# EAGLE design oldDQ542MA GRBL (EAGLE 8.6.1)
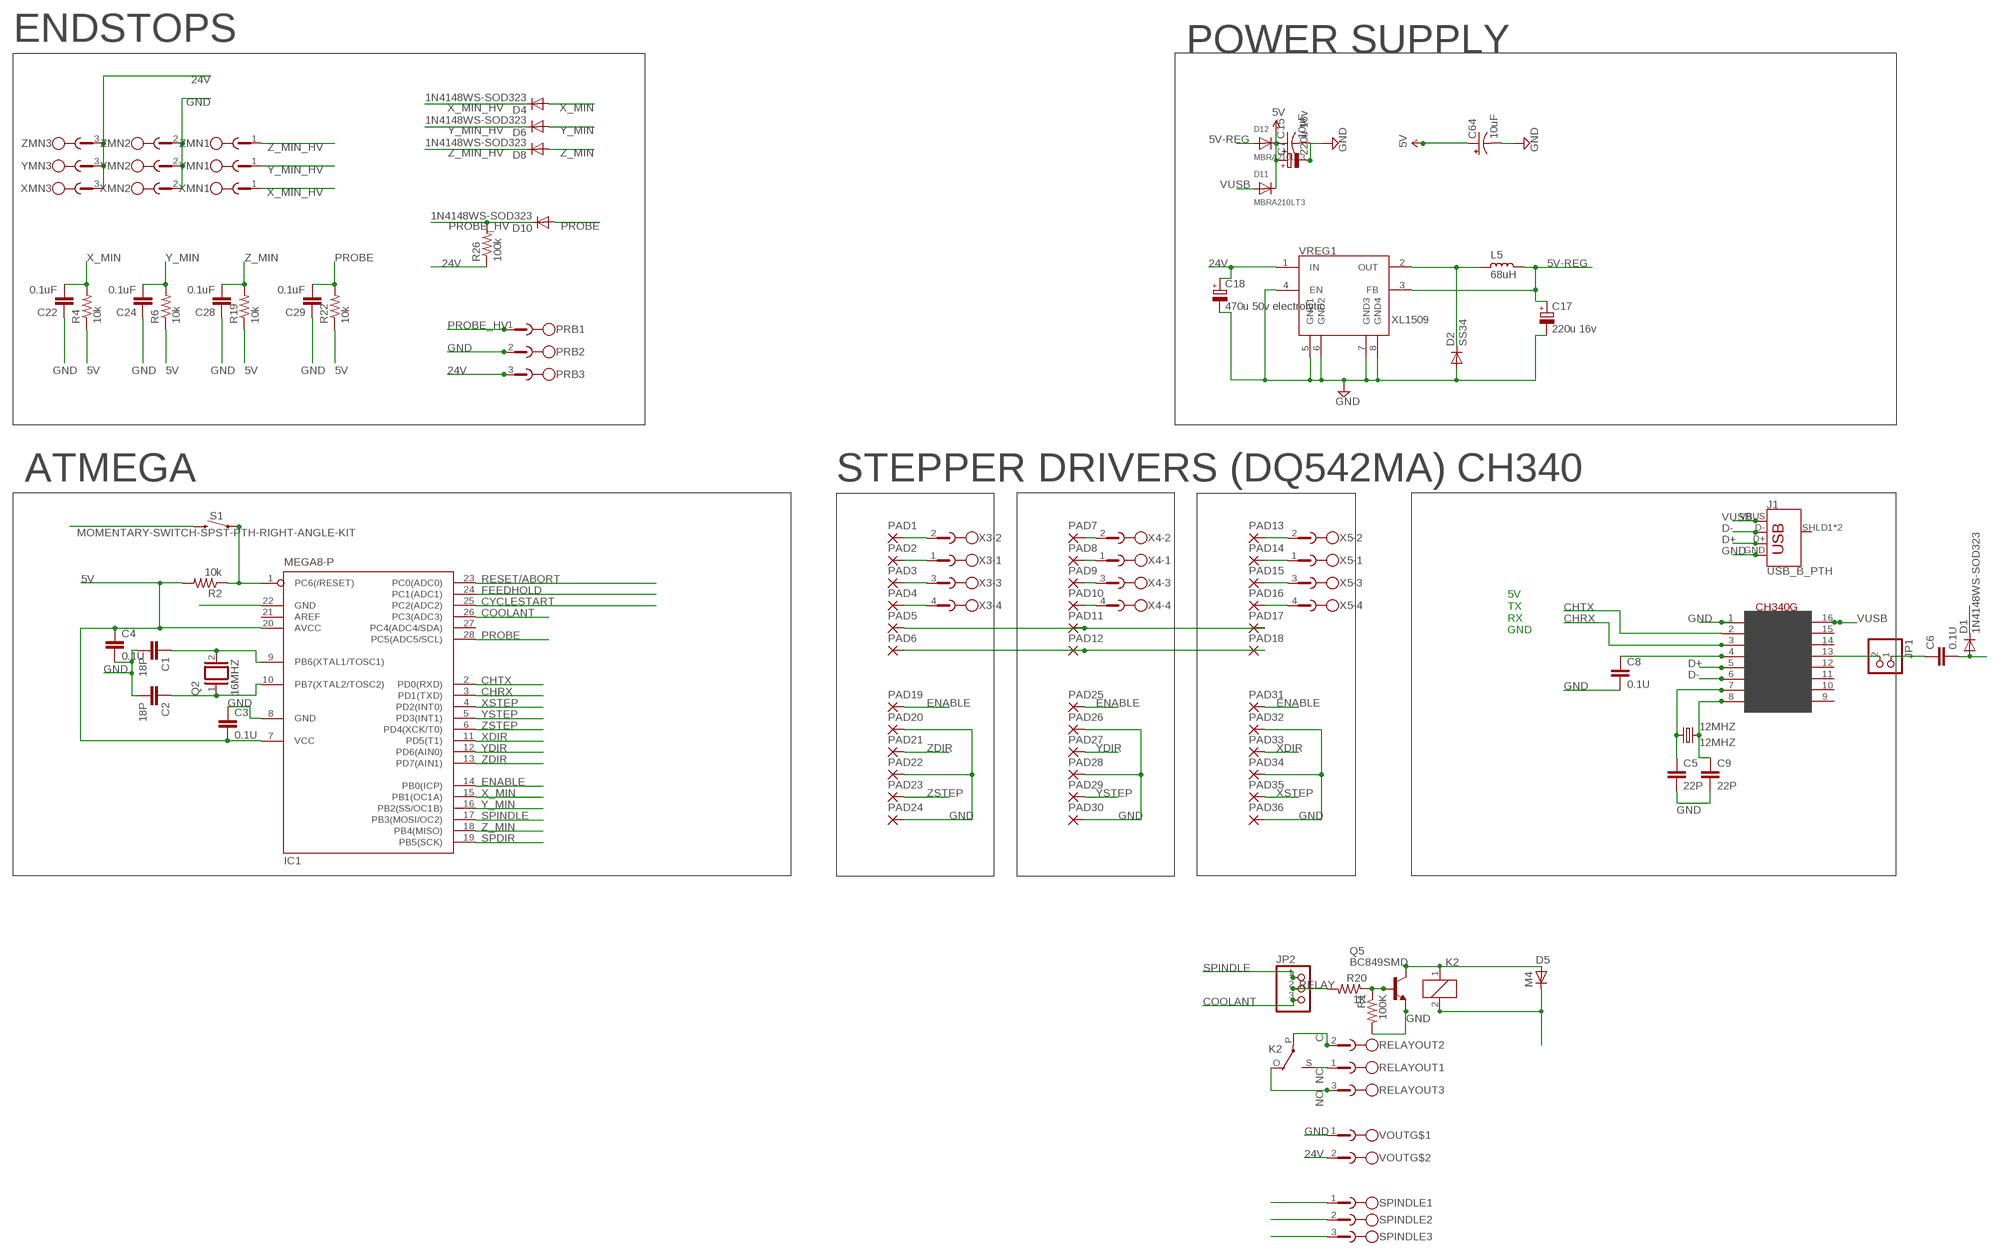
[diagram p0: schematic, sheet 1]

## Parts
12MHZ  12MHZ  CRYSTALHC49U70  [HC49U70]
C1  18P  C-EUC1206  [C1206]
C2  18P  C-EUC1206  [C1206]
C3  0.1U  C-EUC1206  [C1206]
C4  0.1U  C-EUC1206  [C1206]
C5  22P  C-EUC1206  [C1206]
C6  0.1U  C-EUC1206  [C1206]
C7  220u 16v  CPOL-EUE3.5-10  [E3,5-10]
C8  0.1U  C-EUC1206  [C1206]
C9  22P  C-EUC1206  [C1206]
C15  10uF  CAP_POL1206  [EIA3216]
C17  220u 16v  CPOL-EUE3.5-10  [E3,5-10]
C18  470u 50v electrolytic  CPOL-EUE3.5-10  [E3,5-10]
C22  0.1uF  C-EUC1206  [C1206]
C24  0.1uF  C-EUC1206  [C1206]
C28  0.1uF  C-EUC1206  [C1206]
C29  0.1uF  C-EUC1206  [C1206]
C64  10uF  CAP_POL1206  [EIA3216]
D1  1N4148WS-SOD323  DIODE-SOD80C  [SOD80C]
D2  SS34  DIODE-DO-214AC  [DO-214AC]
D4  1N4148WS-SOD323  DIODE-SOD80C  [SOD80C]
D5  M4  D-SOD-80  [SOD80]
D6  1N4148WS-SOD323  DIODE-SOD80C  [SOD80C]
D8  1N4148WS-SOD323  DIODE-SOD80C  [SOD80C]
D10  1N4148WS-SOD323  DIODE-SOD80C  [SOD80C]
D11  MBRA210LT3  DIODESMA  [SMADIODE]
D12  MBRA210LT3  DIODESMA  [SMADIODE]
IC1  MEGA8-P  [DIL28-3]
J1  USB_B_PTH  [USB-B-PTH]
JP1  PINHD-1X2  [1X02]
JP2  PINHD-1X3  [1X03]
K2  G5L  [G5LE]
L5  68uH  L_CD75  [CD75]
PAD1  3,81/1,4  [3,81/1,4]
PAD2  3,81/1,4  [3,81/1,4]
PAD3  3,81/1,4  [3,81/1,4]
PAD4  3,81/1,4  [3,81/1,4]
PAD5  3,81/1,4  [3,81/1,4]
PAD6  3,81/1,4  [3,81/1,4]
PAD7  3,81/1,4  [3,81/1,4]
PAD8  3,81/1,4  [3,81/1,4]
PAD9  3,81/1,4  [3,81/1,4]
PAD10  3,81/1,4  [3,81/1,4]
PAD11  3,81/1,4  [3,81/1,4]
PAD12  3,81/1,4  [3,81/1,4]
PAD13  3,81/1,4  [3,81/1,4]
PAD14  3,81/1,4  [3,81/1,4]
PAD15  3,81/1,4  [3,81/1,4]
PAD16  3,81/1,4  [3,81/1,4]
PAD17  3,81/1,4  [3,81/1,4]
PAD18  3,81/1,4  [3,81/1,4]
PAD19  3,81/1,4  [3,81/1,4]
PAD20  3,81/1,4  [3,81/1,4]
PAD21  3,81/1,4  [3,81/1,4]
PAD22  3,81/1,4  [3,81/1,4]
PAD23  3,81/1,4  [3,81/1,4]
PAD24  3,81/1,4  [3,81/1,4]
PAD25  3,81/1,4  [3,81/1,4]
PAD26  3,81/1,4  [3,81/1,4]
PAD27  3,81/1,4  [3,81/1,4]
PAD28  3,81/1,4  [3,81/1,4]
PAD29  3,81/1,4  [3,81/1,4]
PAD30  3,81/1,4  [3,81/1,4]
PAD31  3,81/1,4  [3,81/1,4]
PAD32  3,81/1,4  [3,81/1,4]
PAD33  3,81/1,4  [3,81/1,4]
PAD34  3,81/1,4  [3,81/1,4]
PAD35  3,81/1,4  [3,81/1,4]
PAD36  3,81/1,4  [3,81/1,4]
PRB  Phoenix Pluggable 3.81mm 3 way  MC1.5/3  [MC1.5/3-G-3.81]
Q2  16MHZ  XTAL/S  [QS]
Q5  BC849SMD  [SOT23-BEC]
R1  100K  R-US_R1206  [R1206]
R2  10k  R-US_R1206  [R1206]
R4  10k  R-US_R1206  [R1206]
R6  10k  R-US_R1206  [R1206]
R19  10k  R-US_R1206  [R1206]
R20  1K  R-US_R1206  [R1206]
R22  10k  R-US_R1206  [R1206]
R26  100k  R-US_R1206  [R1206]
RELAYOUT  Phoenix Pluggable 3.81mm 3 way  MC1.5/3  [MC1.5/3-G-3.81]
S1  MOMENTARY-SWITCH-SPST-PTH-RIGHT-ANGLE-KIT  [TACTILE_SWITCH_PTH_RIGHT_ANGLE_KIT]
SPINDLE  Phoenix Pluggable 3.81mm 3 way  MC1.5/3  [MC1.5/3-G-3.81]
U$2  CH340G  [SOIC16]
VOUT  Phoenix Pluggable 3.81mm 2 way  MC1.5/2  [MC1.5/2-G-3.81]
VREG1  XL1509  [SO08]
X3  Phoenix Pluggable 3.81mm 4 way  MC1.5/4  [MC1.5/4-G-3.81]
X4  Phoenix Pluggable 3.81mm 4 way  MC1.5/4  [MC1.5/4-G-3.81]
X5  Phoenix Pluggable 3.81mm 4 way  MC1.5/4  [MC1.5/4-G-3.81]
XMN  Phoenix Pluggable 3.81mm 3 way  MC1.5/3  [MC1.5/3-G-3.81]
YMN  Phoenix Pluggable 3.81mm 3 way  MC1.5/3  [MC1.5/3-G-3.81]
ZMN  Phoenix Pluggable 3.81mm 3 way  MC1.5/3  [MC1.5/3-G-3.81]

## Nets
5V: C3.2 C4.1 C7.+ C15.A(+) C64.A(+) D1.C D5.1(C) D11.C D12.C IC1.7(VCC) IC1.20(AVCC) K2.2 R2.2 R4.1 R6.1 R19.1 R22.1
5V-REG: C17.+ D12.A L5.1 VREG1.3(FB)
24V: C18.+ PAD6.1(P) PAD12.1(P) PAD18.1(P) PRB.3 R26.1 VOUT.2 VREG1.1(IN) XMN.3 YMN.3 ZMN.3
C: K2.P(2:P) RELAYOUT.2
CHRX: IC1.3(PD1(TXD)) U$2.3(RX)
CHTX: IC1.2(PD0(RXD)) U$2.2(TX)
COIL-: D5.2(A) K2.1 Q5.C
COOLANT: IC1.26(PC3(ADC3)) JP2.3
CYCLESTART: IC1.25(PC2(ADC2))
D+: J1.D+ U$2.5(D+)
D-: J1.D- U$2.6(D-)
DTR: JP1.2 U$2.13(DTR)
ENABLE: IC1.14(PB0(ICP)) PAD19.1(P) PAD25.1(P) PAD31.1(P)
FEEDHOLD: IC1.24(PC1(ADC1))
GND: C1.2 C2.2 C3.1 C4.2 C5.2 C7.- C8.2 C9.2 C15.C(-) C17.- C18.- C22.1 C24.1 C28.1 C29.1 C64.C(-) D2.2(A) IC1.8(GND) IC1.22(GND) J1.GND PAD5.1(P) PAD11.1(P) PAD17.1(P) PAD20.1(P) PAD22.1(P) PAD24.1(P) PAD26.1(P) PAD28.1(P) PAD30.1(P) PAD32.1(P) PAD34.1(P) PAD36.1(P) PRB.2 Q5.E R1.2 S1.2 SPINDLE.1 U$2.1(GND) VOUT.1 VREG1.4(EN) VREG1.5(GND1) VREG1.6(GND2) VREG1.7(GND3) VREG1.8(GND4) XMN.2 YMN.2 ZMN.2
N$2: C6.1 JP1.1
N$3: C1.1 IC1.9(PB6(XTAL1/TOSC1)) Q2.2
N$5: C2.1 IC1.10(PB7(XTAL2/TOSC2)) Q2.1
N$6: PAD10.1(P) X4.4
N$8: PAD8.1(P) X4.1
N$9: 12MHZ.1 C5.1 U$2.7(XI)
N$10: PAD7.1(P) X4.2
N$11: 12MHZ.2 C9.1 U$2.8(XO)
N$13: PAD2.1(P) X3.1
N$14: PAD1.1(P) X3.2
N$15: PAD14.1(P) X5.1
N$16: PAD13.1(P) X5.2
N$32: PAD4.1(P) X3.4
N$35: PAD3.1(P) X3.3
N$38: PAD9.1(P) X4.3
N$40: PAD16.1(P) X5.4
N$42: Q5.B R1.1 R20.1
N$43: PAD15.1(P) X5.3
N$292: D2.1(C) L5.2 VREG1.2(OUT)
NC: K2.S(2:S) RELAYOUT.1
NO: K2.O(2:O) RELAYOUT.3
PROBE: C29.2 D10.A IC1.28(PC5(ADC5/SCL)) R22.2
PROBE_HV: D10.C PRB.1 R26.2
RELAY: JP2.2 R20.2
RESET: C6.2 D1.A IC1.1(PC6(/RESET)) R2.1 S1.1
RESET/ABORT: IC1.23(PC0(ADC0))
SPDIR: IC1.19(PB5(SCK)) SPINDLE.3
SPINDLE: IC1.17(PB3(MOSI/OC2)) JP2.1 SPINDLE.2
V3: C8.1 U$2.4(V3)
VUSB: D11.A J1.VBUS U$2.16(VCC)
X_MIN: C22.2 D4.A IC1.15(PB1(OC1A)) R4.2
X_MIN_HV: D4.C XMN.1
XDIR: IC1.11(PD5(T1)) PAD33.1(P)
XSTEP: IC1.4(PD2(INT0)) PAD35.1(P)
Y_MIN: C24.2 D6.A IC1.16(PB2(SS/OC1B)) R6.2
Y_MIN_HV: D6.C YMN.1
YDIR: IC1.12(PD6(AIN0)) PAD27.1(P)
YSTEP: IC1.5(PD3(INT1)) PAD29.1(P)
Z_MIN: C28.2 D8.A IC1.18(PB4(MISO)) R19.2
Z_MIN_HV: D8.C ZMN.1
ZDIR: IC1.13(PD7(AIN1)) PAD21.1(P)
ZSTEP: IC1.6(PD4(XCK/T0)) PAD23.1(P)
Unconnected: IC1.21(AREF) IC1.27(PC4(ADC4/SDA)) J1.SHLD1(SHIELD) J1.SHLD2(SHIELD) U$2.9(CTS) U$2.10(DSR) U$2.11(RI) U$2.12(DCD) U$2.14(RTS) U$2.15(RS232)

## Notes on the sheet
- ENDSTOPS | POWER SUPPLY
- ATMEGA | STEPPER DRIVERS (DQ542MA) | CH340
- 5V
  TX
  RX
  GND

## Library data of the parts
12MHZ = crystal:CRYSTAL: CRYSTAL; OC_FARNELL: unknown; OC_NEWARK: unknown
C1-C6 C8 C9 C22 C24 C28 C29 = rcl:C-EU: CAPACITOR, European symbol
C7 C17 C18 = rcl:CPOL-EU: POLARIZED CAPACITOR, European symbol
C15 C64 = SparkFun:CAP_POL: Capacitor Polarized These are standard SMD and PTH capacitors. Normally 10uF, 47uF, and 100uF in electrolytic and tantalum varieties. Always verify the external diameter of the through hole cap, it varies with capacity, voltage, and manufacturer. The EIA devices should be standard.
D1 D4 D6 D8 D10 = diode:DIODE-: DIODE
D2 = dp_devices:DIODE: Various Diode Packages
D5 = semicon-smd-ipc:D-: DIODE unfilled
D11 D12 = microbuilder:DIODE: Diode SMADIODE - SMA Surface Mount Package 20V 1A Schottky Diode Digikey (500mV @ 1A, 500uA Vr @ 20V): 641-1014-6-ND 10V 2A Schottky Diode Digikey (350mV @ 2A, 700uA Vr @ 10V): MBRA210LT3 SOD-123 30V 200mA (800mV Vf, 2uA Vr @ 25V) Schottky Diode (very fast switching for boost, etc.) - Digikey: BAT54T1GOSTR-ND 30V 500mA (430mV Vf, 130uA Vr @ 30V) Schottky Diode - Digikey: B0530W-FDICT-ND MBR120 1A 20V (0.34Vf) Schottky Diode - Digikey: MBR120VLSFT1GOSCT-ND SOD-323 10V 570mA (380mV Vf, 3ns) Schottky Diode - Digikey: ZLLS410CT-ND 1N4148WS - 75V 150mA (1V Vf @ 10mA, 4ns) Simple Diode - Digikey: 1N4148WSFSCT-ND, Mouser: 512-1N4148WS SOD-523 BAT54 30V 200mA Schottky (0.8 Vf @ 100mA, 5ns) - Digikey: BAT54XV2CT-ND 30V 30mA Schottky Diode (RB751S-40TE61) - Digikey: RB751S-40TE61CT-ND SOT23-R/W - SOT23 Package (R = Solder Paste/Reflow Ovens, W = Hand-Soldering) BAT54Film 40V 300mA - Digikey: 497-7162-1-ND DO-1N4148 Through Hole Small Current Diode (any model)
IC1 = atmel:MEGA8-P: MICROCONTROLLER 8 Kbytes FLASH, 1 kbytes SRAM, 512 bytes EEPROM, USART, 4-channel 10 bit ADC, 2-channel 8 bit ADC Pin compatible with Atmega48, ATMega88, ATMega168 Source: avr.lbr; OC_FARNELL: unknown; OC_NEWARK: unknown
J1 = SparkFun-Connectors:USB_B: USB Type B Connector SparkFun Products: SparkFun Stepoko <https://www.sparkfun.com/products/13899> PTH; PROD_ID: CONN-08278; SF_ID: PRT-00139
JP1 = pinhead:PINHD-1X2: PIN HEADER
JP2 = pinhead:PINHD-1X3: PIN HEADER
K2 = relay:G5L: RELAY 1 x switch, 10 A/120 V AC, 8 A/30 V ADC, Omron; OC_FARNELL: unknown; OC_NEWARK: unknown
L5 = rc-master-smd:L_: INDUCTOR
PAD1-PAD36 = wirepad:3,81/1,4: THROUGH-HOLE PAD
PRB RELAYOUT SPINDLE XMN YMN ZMN = jt-con-phoenix-3.81:MC1.5/3: PHOENIX
Q2 = special:XTAL/S: CRYSTAL
Q5 = transistor-npn:BC849*: NPN Transistor
R1 R20 = adafruit:R-US_: RESISTOR, American symbol
R2 R4 R6 R19 R22 R26 = resistor:R-US_: RESISTOR, American symbol
S1 = SparkFun-Switches:MOMENTARY-SWITCH-SPST: Momentary Switch (Pushbutton) - SPST Normally-open (NO) SPST momentary switches (buttons, pushbuttons). Variants PTH-12MM - 12mm square, through-hole Momentary Pushbutton Switch - 12mm Square <https://www.sparkfun.com/products/9190> (COM-09190) PTH-6.0MM, PTH-6.0MM-KIT - 6.0mm square, through-hole Mini Pushbutton Switch <https://www.sparkfun.com/products/97> (COM-00097) KIT package intended for soldering kit's - only one side of pads' copper is exposed. PTH-RIGHT-ANGLE-KIT - Right-angle, through-hole Right Angle Tactile Button <https://www.sparkfun.com/products/10791> - Used on SparkFun BigTime Watch Kit <https://www.sparkfun.com/products/11734> SMD-12MM - 12mm square, surface-mount Tactile Button - SMD (12mm) <https://www.sparkfun.com/products/12993> (COM-12993) Used on SparkFun PicoBoard <https://www.sparkfun.com/products/11888> SMD-4.5MM - 4.5mm Square Trackball Switch Used on SparkFun Blackberry Trackballer Breakout <https://www.sparkfun.com/products/13169> SMD-4.6MMX2.8MM - 4.60mm x 2.80mm, surface mount Used on SparkFun SAMD21 Mini Breakout <https://www.sparkfun.com/products/13664> SMD-5.2MM, SMD-5.2-REDUNDANT - 5.2mm square, surface-mount Mini Pushbutton Switch - SMD <https://www.sparkfun.com/products/8720> (COM-08720) Used on Arduino Pro Mini <https://www.sparkfun.com/products/11114> REDUNDANT package connects both switch circuits together SMD-6.0X3.5MM - 6.0 x 3.5mm, surface mount Momentary Reset Switch SMD <https://www.sparkfun.com/products/8229> (COM-08229) SMD-6.2MM-TALL - 6.2mm square, surface mount Tactile Button - SMD (6mm) <https://www.sparkfun.com/products/12992> Used on SparkFun Digital Sandbox <https://www.sparkfun.com/products/12651> SMD-RIGHT-ANGLE - Right-angle, surface mount Used on SparkFun Block for Intel® Edison - Arduino <https://www.sparkfun.com/products/13036>; PROD_ID: CONN-10672; SF_SKU: COM-10791
U$2 = usb-serial:CH340G
VOUT = jt-con-phoenix-3.81:MC1.5/2
VREG1 = Cohesion_parts:XL1509
X3-X5 = jt-con-phoenix-3.81:MC1.5/4: PHOENIX

## Net classes
1 power: width 0.6 mm, clearance 0.305 mm
5 3.3-Amp Class: width 1.27 mm

## Board
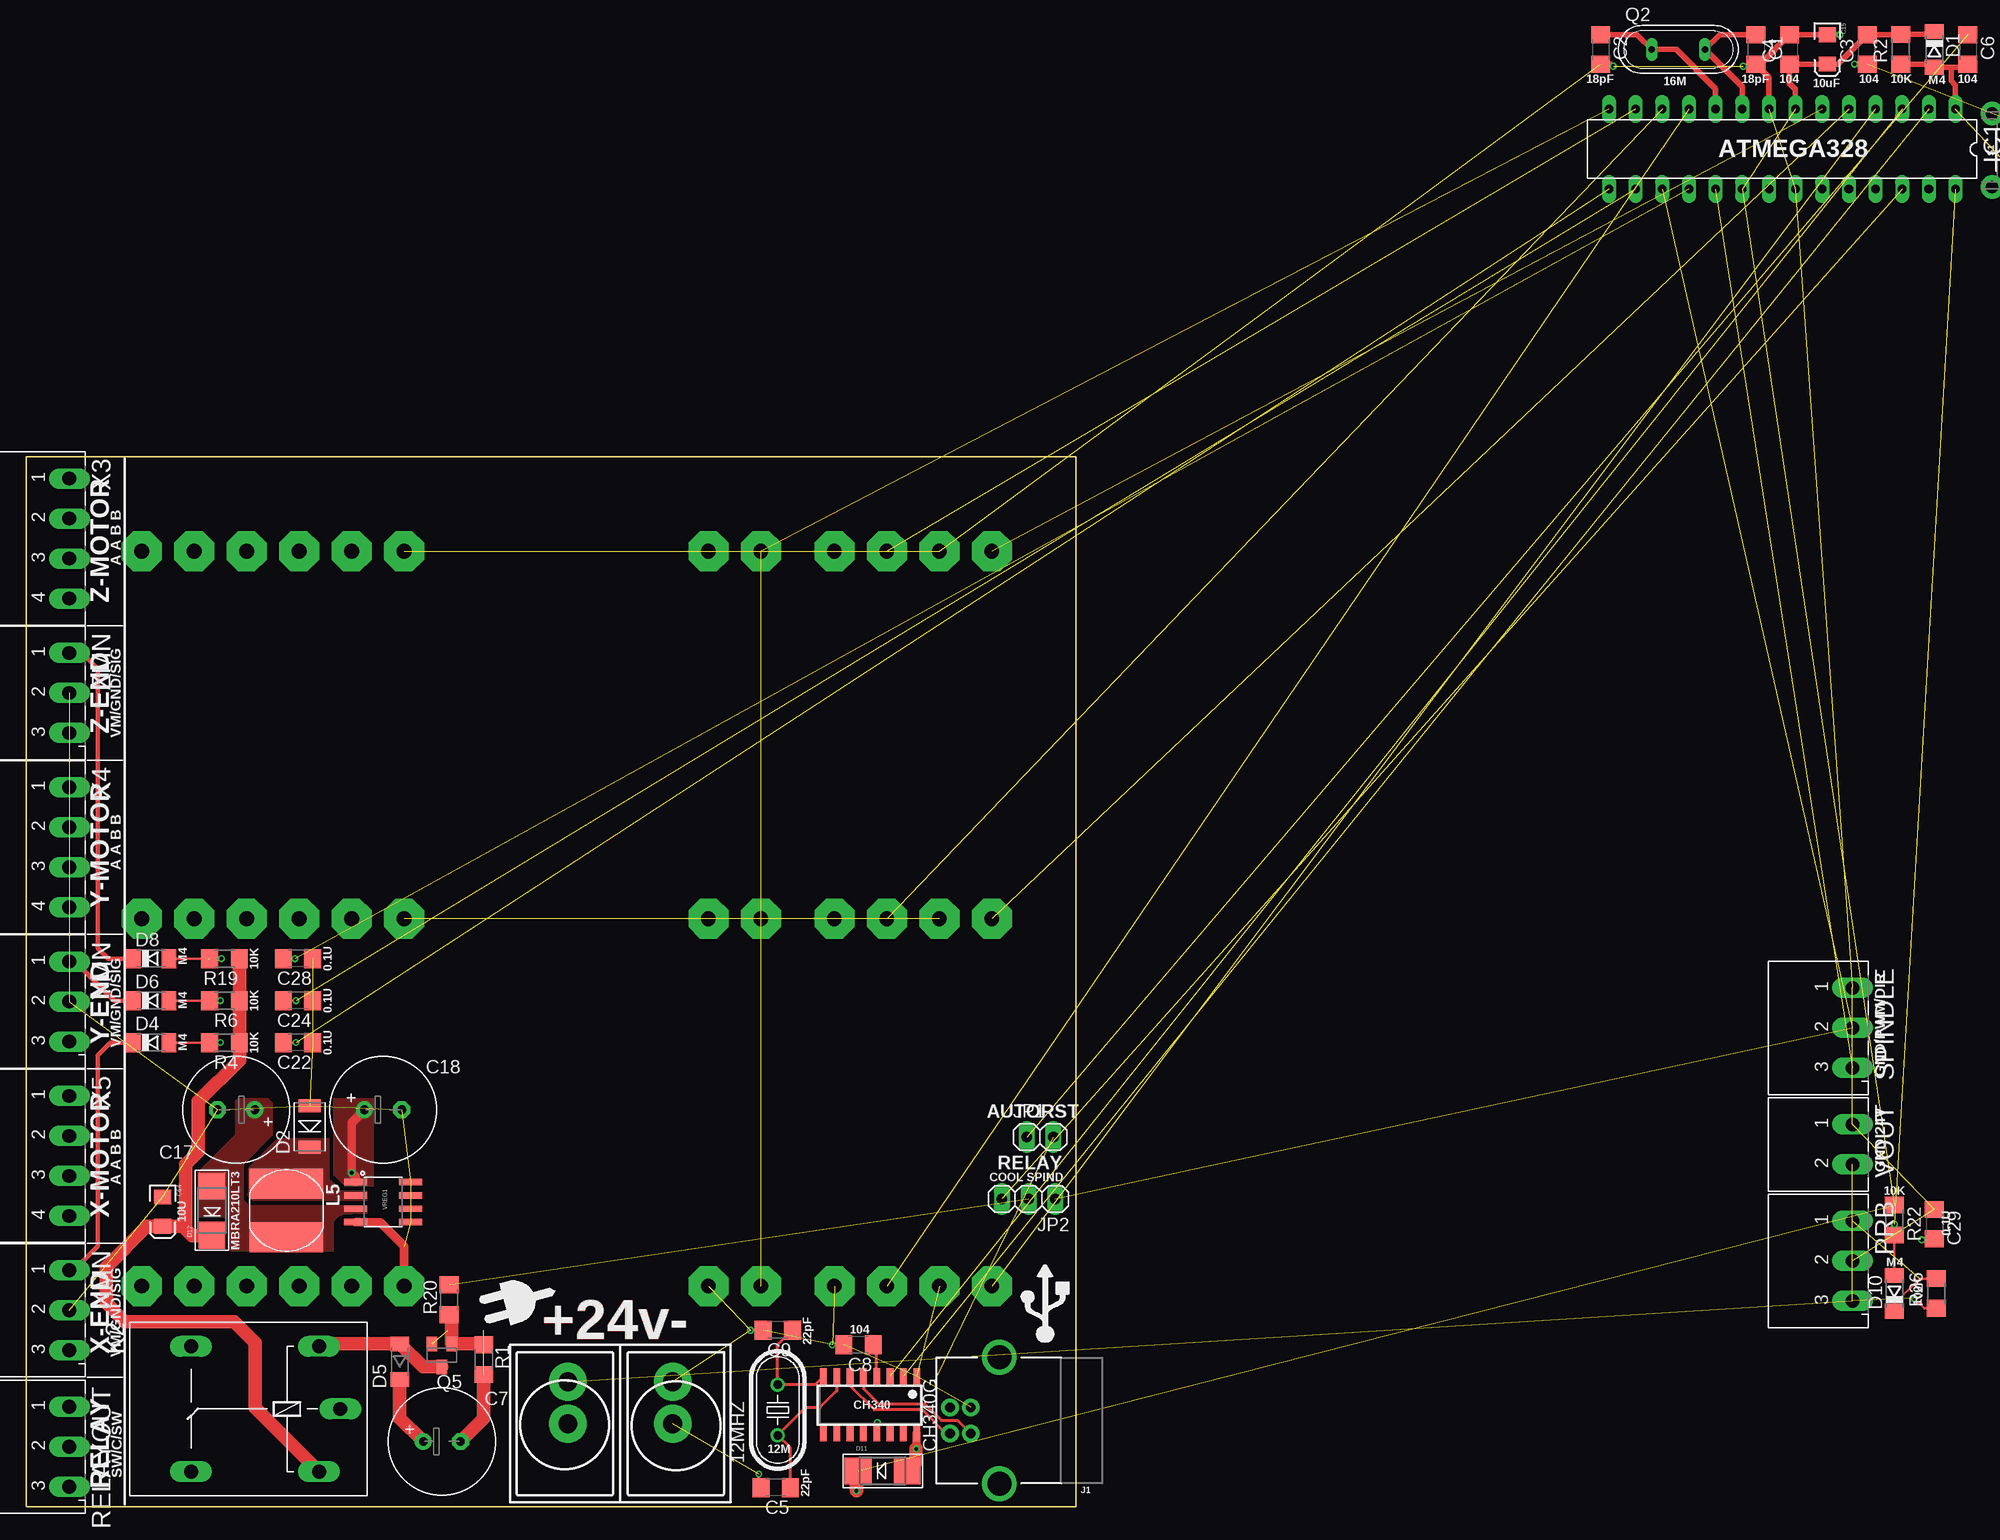
[diagram p1: board, top side]
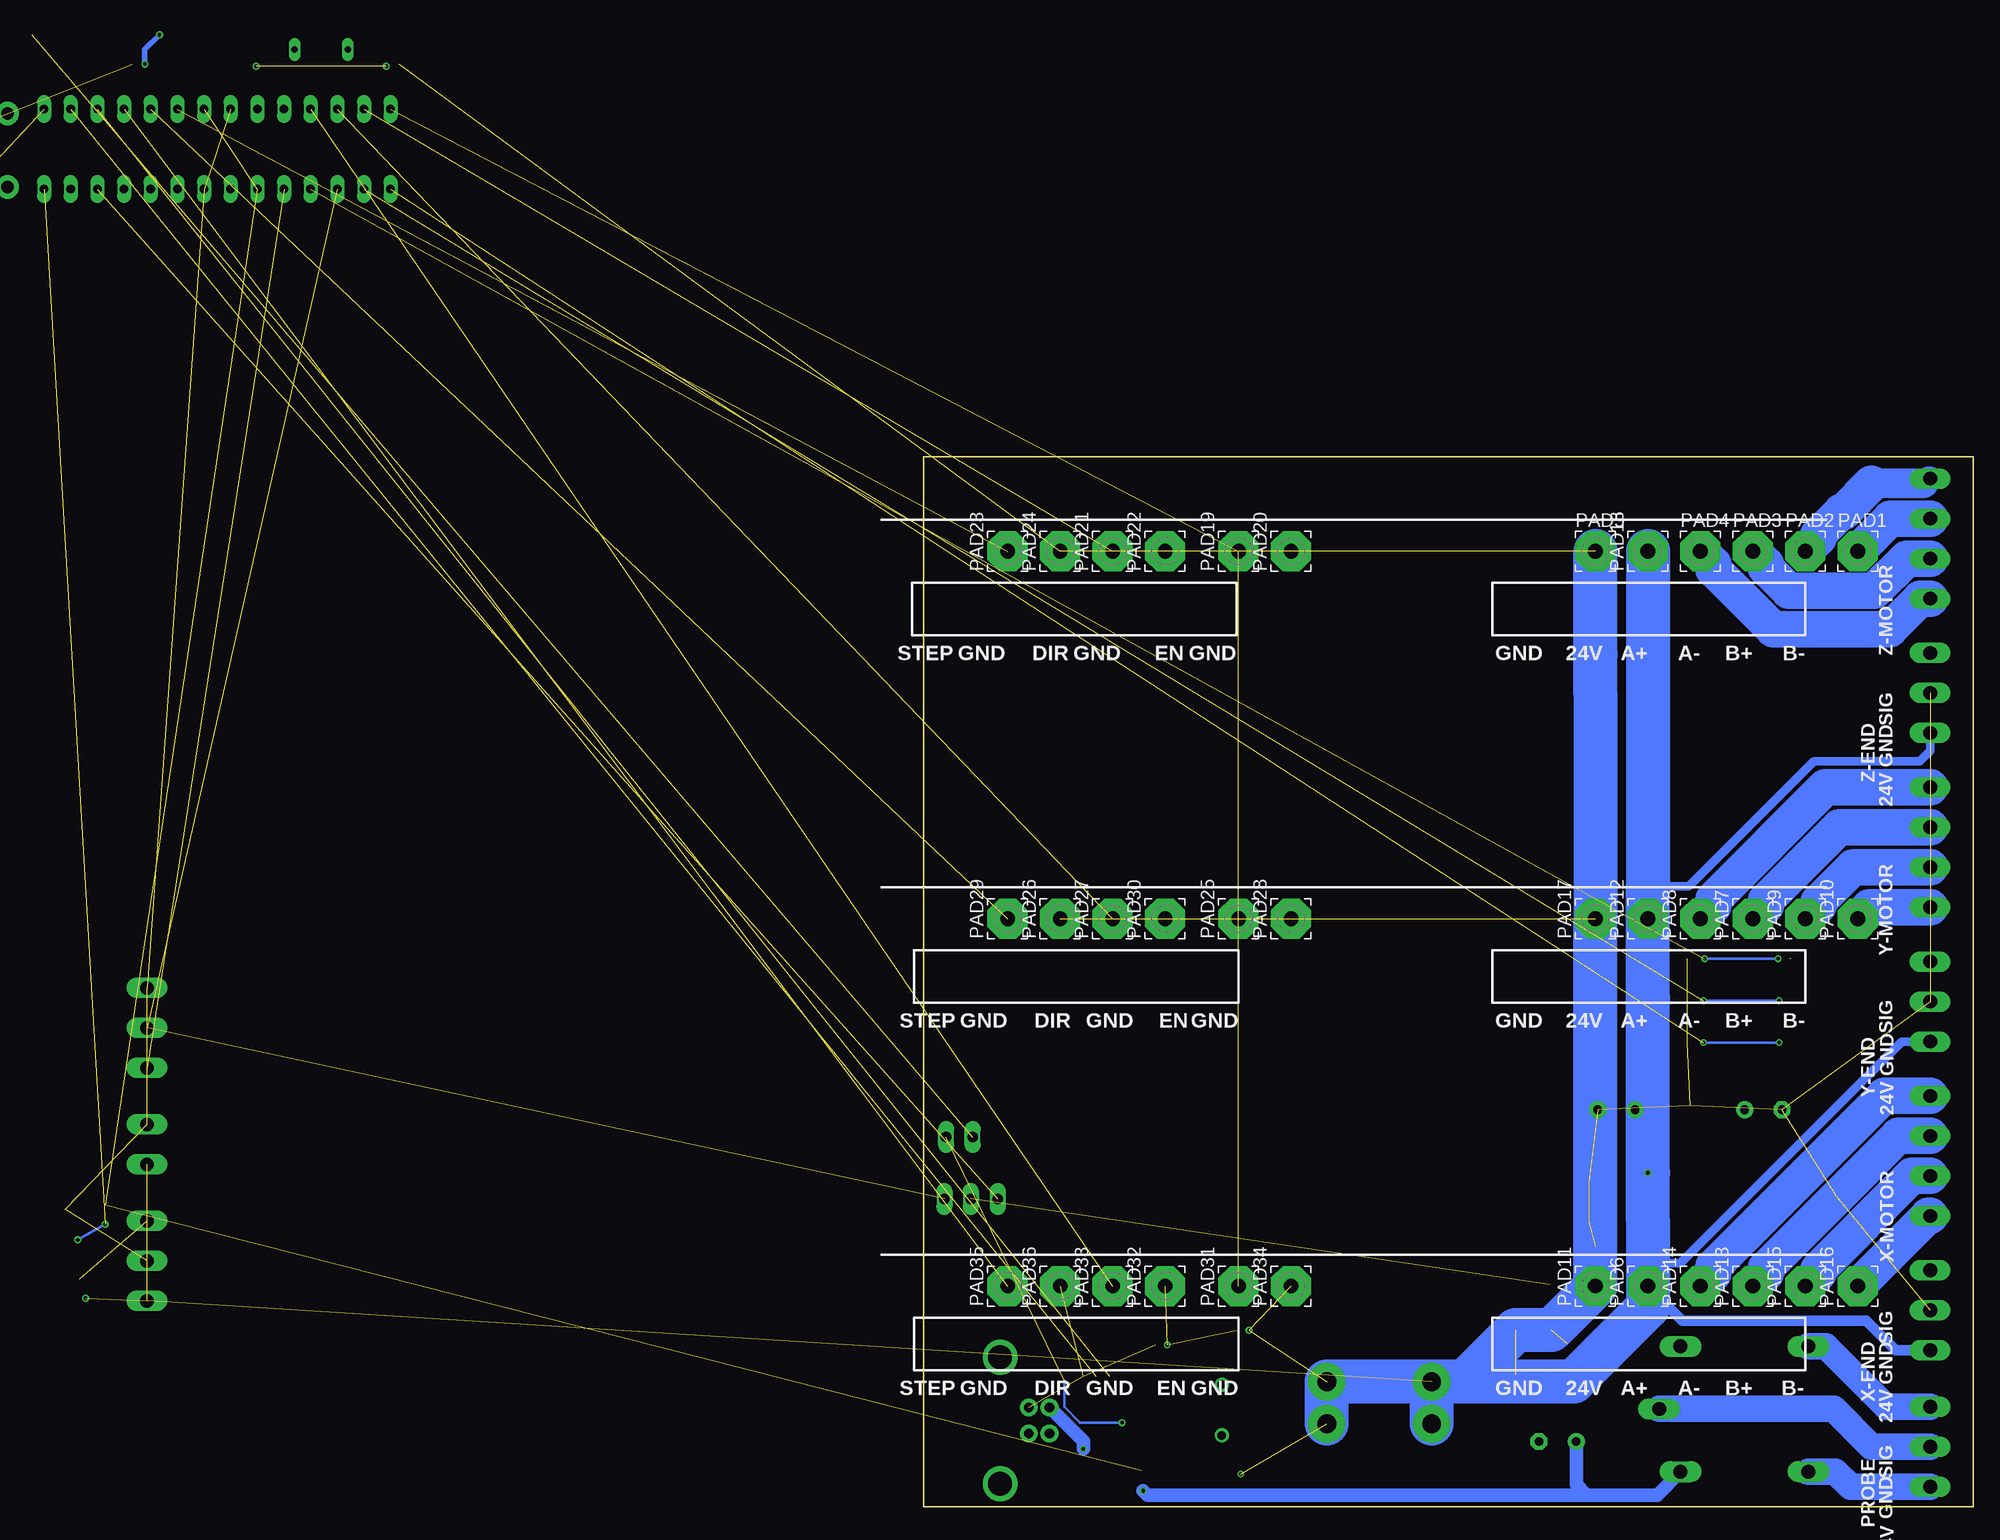
[diagram p2: board, bottom side, seen from below]

Size 100 x 100 mm. Coordinates in mm from the lower left corner, seen from the top.
Outline: 100,100 100,0 0,0 0,100 100,100
Copper layers (1*16): Top 0.035mm / dielectric 1.5mm / Bottom 0.035mm
Design rules "dirt_cheap_dirty_boards.v1": minimum track width 5mil, minimum drill 12mil, track to track 5mil, track to pad 5mil, pad to pad 5mil, via to via 5mil, smd to smd 0mil, copper to edge 10mil, drill to drill 10mil, minimum pad ring 10mil, minimum via ring 6mil, stop-mask expansion 2mil, vias tented up to drill 25mil, thermal gap 10mil
tRestrict: area 43.2,17.3 to 50.4,21.5

### Footprints (pad centres in the part's own frame; a part is rotated, then mirrored left to right if it is on the bottom)
HC49U70 = drill 0.813: 1 -2.413,0; 2 2.413,0
C1206 = smd 1.6 x 1.8: 1 -1.4,0; 2 1.4,0
E3,5-10 = drill 0.813 pad 1.6: + -1.778,0 | drill 0.813 pad 1.6 octagon: - 1.778,0
EIA3216 = smd 1.4 x 1.6: A 1.4,0; C -1.4,0
SOD80C = smd 1.4 x 1.8: A 1.7,0; C -1.7,0
DO-214AC = smd 1.27 x 2.1: 1 -1.98,0; 2 1.98,0
SOD80 = smd 1.4 x 1.8: 1 -1.7,0; 2 1.7,0
SMADIODE = smd 2.54 x 2.54: A 2.349,0; C -2.349,0
DIL28-3 = drill 0.813 long: 1 -16.51,-3.81; 2 -13.97,-3.81; 3 -11.43,-3.81; 4 -8.89,-3.81; 5 -6.35,-3.81; 6 -3.81,-3.81; 7 -1.27,-3.81; 8 1.27,-3.81; 9 3.81,-3.81; 10 6.35,-3.81; 11 8.89,-3.81; 12 11.43,-3.81; 13 13.97,-3.81; 14 16.51,-3.81; 15 16.51,3.81; 16 13.97,3.81; 17 11.43,3.81; 18 8.89,3.81; 19 6.35,3.81; 20 3.81,3.81; 21 1.27,3.81; 22 -1.27,3.81; 23 -3.81,3.81; 24 -6.35,3.81; 25 -8.89,3.81; 26 -11.43,3.81; 27 -13.97,3.81; 28 -16.51,3.81
USB-B-PTH = drill 0.914 pad 1.676: D+ 4,1.25; D- 5.981,1.25; GND 4,-1.25; VBUS 5.981,-1.25 | drill 2.286: SHLD1 1.282,-6.02; SHLD2 1.282,6.02
1X02 = drill 1.016 long: 1 -1.27,0; 2 1.27,0
1X03 = drill 1.016 long: 1 -2.54,0; 2 0,0; 3 2.54,0
G5LE = drill 1.321 long: 1 -7.493,-5.969; 2 -7.493,5.969; O 4.699,5.969; P -9.525,0; S 4.699,-5.969
CD75 = smd 7 x 2.85: 1 0,2.54; 2 0,-2.54
3,81/1,4 = drill 1.397 pad 3.81 octagon: 1 0,0
MC1.5/3-G-3.81 = drill 1.3 long: 1 -3.81,8; 2 0,8; 3 3.81,8
QS = drill 0.61 long: 1 -2.54,0; 2 2.54,0
SOT23-BEC = smd 1 x 1.4: B -0.95,-1.1; C 0,1.1; E 0.95,-1.1
R1206 = smd 1.6 x 1.803: 1 -1.422,0; 2 1.422,0
TACTILE_SWITCH_PTH_RIGHT_ANGLE_KIT = drill 0.8 pad 1.7: 1 -2.5,0; 2 2.5,0 | drill 1.2 pad 2.2: ANCHOR1 -3.5,2.5; ANCHOR2 3.5,2.5
SOIC16 = smd 0.635 x 1.524: 1 -4.445,-2.695; 2 -3.175,-2.695; 3 -1.905,-2.695; 4 -0.635,-2.695; 5 0.635,-2.695; 6 1.905,-2.695; 7 3.175,-2.695; 8 4.445,-2.695; 9 4.445,2.695; 10 3.175,2.695; 11 1.905,2.695; 12 0.635,2.695; 13 -0.635,2.695; 14 -1.905,2.695; 15 -3.175,2.695; 16 -4.445,2.695
MC1.5/2-G-3.81 = drill 1.3 long: 1 -3.81,8; 2 0,8
SO08 = smd 0.61 x 2.21: 1 -1.905,-2.616; 2 -0.635,-2.616; 3 0.635,-2.616; 4 1.905,-2.616; 5 1.905,2.616; 6 0.635,2.616; 7 -0.635,2.616; 8 -1.905,2.616
MC1.5/4-G-3.81 = drill 1.3 long: 1 -9.525,8; 2 -5.715,8; 3 -1.905,8; 4 1.905,8

### Placement (x,y rotation side)
12MHZ  71.6,9.2 90 top
C1  164.8,138.8 270 top  (outside the outline)
C2  150,138.8 270 top  (outside the outline)
C3  175.4,138.8 90 top  (outside the outline)
C4  168,138.8 90 top  (outside the outline)
C5  71.4,1.8 180 top
C6  185,138.8 270 top  (outside the outline)
C7  39.6,6.2 0 top
C8  79.3,15.4 180 top
C9  71.6,16.8 180 top
C15  171.6,138.8 270 top  (outside the outline)
C17  20,37.8 180 top
C18  34,37.8 0 top
C22  25.9,44.2 180 top
C24  25.9,48.2 180 top
C28  25.9,52.2 180 top
C29  181.8,26.9 270 top  (outside the outline)
C64  13,28.1 270 top
D1  181.8,138.8 270 top  (outside the outline)
D2  27,36.2 90 top
D4  11.9,44.2 0 top
D5  35.6,13.8 90 top
D6  11.9,48.2 0 top
D8  11.9,52.2 0 top
D10  178,20.3 90 top  (outside the outline)
D11  81.6,3.4 0 top
D12  17.7,28.2 90 top
IC1  167.3,129.3 180 top  (outside the outline)
J1  94,8.2 180 top
JP1  96.6,35.2 0 top
JP2  95.5,29.3 180 top
K2  20.4,9.3 180 top
L5  24.8,28.2 180 top
PAD1  11,91 0 bottom
PAD2  16,91 0 bottom
PAD3  21,91 0 bottom
PAD4  26,91 0 bottom
PAD5  36,91 0 bottom
PAD6  31,21 90 bottom
PAD7  21,56 90 bottom
PAD8  26,56 90 bottom
PAD9  16,56 90 bottom
PAD10  11,56 90 bottom
PAD11  36,21 90 bottom
PAD12  31,56 90 bottom
PAD13  21,21 90 bottom
PAD14  26,21 90 bottom
PAD15  16,21 90 bottom
PAD16  11,21 90 bottom
PAD17  36,56 90 bottom
PAD18  31,91 90 bottom
PAD19  70,91 90 bottom
PAD20  65,91 90 bottom
PAD21  82,91 90 bottom
PAD22  77,91 90 bottom
PAD23  92,91 90 bottom
PAD24  87,91 90 bottom
PAD25  70,56 90 bottom
PAD26  87,56 90 bottom
PAD27  82,56 90 bottom
PAD28  65,56 90 bottom
PAD29  92,56 90 bottom
PAD30  77,56 90 bottom
PAD31  70,21 90 bottom
PAD32  77,21 90 bottom
PAD33  82,21 90 bottom
PAD34  65,21 90 bottom
PAD35  92,21 90 bottom
PAD36  87,21 90 bottom
PRB  166,23.4 270 top  (outside the outline)
Q2  157.4,138.8 0 top  (outside the outline)
Q5  39.6,14.4 180 top
R1  43.6,14 270 top
R2  178.6,138.8 90 top  (outside the outline)
R4  18.9,44.2 180 top
R6  18.9,48.2 180 top
R19  18.9,52.2 180 top
R20  40.3,19.7 90 top
R22  178,27.3 270 top  (outside the outline)
R26  182,20.3 90 top  (outside the outline)
RELAYOUT  -3.9,5.7 270 top
S1  189.8,129.2 90 top  (outside the outline)
SPINDLE  166,45.6 270 top  (outside the outline)
U$2  80.4,9.7 180 top
VOUT  166,32.6 270 top  (outside the outline)
VREG1  34,29 270 top
X3  -3.9,88.4 270 top
X4  -3.9,59 270 top
X5  -3.9,29.6 270 top
XMN  -3.9,18.7 270 top
YMN  -3.9,48.1 270 top
ZMN  -3.9,77.5 270 top

### Tracks (layer width: path | path; a pad name or v marks a point on that pad's centre or on a via)
5V  (via drill 0.35)  (3 unrouted)
  Top 0.508: D1.C 181.52,140.22 R2.2 178.58,140.2 C3.2 172.6,137.4 C15.A 168.2,137.4 | 168.2,137.4 C4.1 | IC1.7 168.57,135.03 168,135.6 168,137.2 168.2,137.4
  Top 0.813: 17.65,25.8 D12.C
  Top 1.27: R19.1 R6.1 R4.1 20.32,42.52 16.4,38.6 16.4,33.8 15.2,32.6 15.2,26.4 | 15.2,26.4 15.8,25.8 17.65,25.8 | 15.2,26.4 14.9,26.7 C64.A 11.5,26.7 7.6,22.8 7.6,19.4 9.4,17.6 19.8,17.6 21.8,15.6 21.8,9.42 K2.2 | D11.C 79.1,3.25 v79.1,1.5 | D5.1 35.6,8.42 C7.+
  Bottom 1.27: v79.1,1.5 78.7,1.1 36.8,1.1 | K2.2 30.12,1.1 36.8,1.1 | C7.+ 37.82,2.12 36.8,1.1
5V-REG
  pour Top (isolate 0.406, no thermals): 32.4,28.6 21.2,28.6 20.6,29.2 20.6,32.6 23.4,35.4 23.4,38.4 23,38.8 20.2,38.8 20,38.6 20,35.4 16.4,31.8 16.4,27.6 16.6,27.4 19.2,27.4 19.4,27.2 19.4,24.6 19.6,24.4 29.2,24.4 29.2,27.2 29.8,27.8 32.4,27.8
24V  (via drill 0.35, 1.8 pad 3.6)  (3 unrouted)
  Top 0.254: R26.1 180.82,18.88 v179.85,19.85
  Top 0.813: VREG1.1 31.38,31.42 v31,31.8 31,36.58 C18.+
  Bottom 0.254: 31.12,65.8 31,65.8 | 31.22,48.4 31,48.4
  Bottom 0.813: ZMN.3 4.1,72 5.1,71 15.2,71 27.1,59.1 30.85,59.1 31,59.25 | 30.97,27.1 31,27.13 | YMN.3 6.81,44.29 27.9,23.2 31,23.2
  Bottom 1.016: 31.72,21.72 PAD6.1 27.7,17.7 10.2,17.7 7.39,14.89 XMN.3
  Bottom 4.2: PAD18.1 31,65.8 31,59.25 PAD12.1 31,48.4 v31,31.8 31,27.13 31,23.2 PAD6.1 31,19 38.1,11.9 43.8,11.9 v51.6,11.9 v51.6,7.9
  pour Top (isolate 0.406, no thermals): 32.4,30.6 30.4,30.6 29.4,31.6 29.4,38.8 33,38.8 33,30.6
C
  Bottom 2.54: K2.P 13.3,9.3 9.7,5.7 RELAYOUT.2
CHRX  (1 unrouted)
CHTX  (1 unrouted)
COIL-
  Top 1.27: K2.1 28.12,15.5 D5.2 37.8,13.3 Q5.C
COOLANT  (1 unrouted)
D+
  Top 0.305: U$2.5 79.77,11.23 81.2,9.8 85.6,9.8 87.2,8.2 88.75,8.2 J1.D+
D-
  Top 0.305: J1.D- 87.65,6.95 85.4,9.2 80.8,9.2 78.5,11.51 U$2.6
DTR  (via drill 0.35)  (1 unrouted)
  Top 0.254: U$2.13 81.03,7.93 v81.1,8
  Bottom 0.254: v81.1,8 85.1,8 86.6,9.5 86.6,12
ENABLE  (3 unrouted)
GND  (via drill 0.35, 1.8 pad 3.6)  (38 unrouted)
  Top 0.305: C8.2 v76.8,15.4 | C9.2 v69,16.8 | C5.2 69.8,2 v69.8,3.1
  Top 0.508: C2.2 151,137.4 v151.2,137.2 | C1.2 164.6,137.2 v163.6,137.2 | IC1.8 166.03,136.17 C1.2 | C1.2 165.2,137.4 C4.2 C15.C v172.8,140.2 | C3.1 v174.2,137.4
  Top 0.813: VREG1.4 33.7,27.09 36,24.8 PAD11.1
  Top 1.27: R1.2 43.6,8.42 C7.-
  Bottom 0.254: 36,67.12 36,67.3
  Bottom 0.508: v174.2,137.4 174.2,138.8 v172.8,140.2
  Bottom 4: 36.16,81 36,81.16 | 35.88,77.2 36,77.32
  Bottom 4.2: PAD5.1 36,81.16 36,77.32 36,67.3 PAD17.1 PAD11.1 40.2,16.8 43.6,16.8 48.5,11.9 v61.6,11.9 v61.6,7.9
N$2  (1 unrouted)
N$3
  Top 0.508: IC1.9 163.49,135.25 Q2.2 161.34,140.2 C1.1
N$5
  Top 0.508: IC1.10 160.95,135.05 157.2,138.8 Q2.1 153.46,140.2 C2.1
N$6
  Bottom 3.5: X4.4 9.9,57.09 PAD10.1
N$8
  Bottom 3.5: PAD8.1 24.78,57.22 24.78,57.83 14.08,68.53 X4.1
N$9
  Top 0.305: U$2.7 77.22,11.03 75.6,9.4 74.21,9.4 12MHZ.1 72.8,5.59 C5.1
N$10
  Bottom 3.5: PAD7.1 19.78,57.22 19.78,57.7 12.76,64.72 X4.2
N$11
  Top 0.305: U$2.8 75.17,11.61 12MHZ.2 71.6,15.4 C9.1
N$13
  Bottom 2.3: X3.1 4.28,97.92 4.7,97.5
  Bottom 2.8: 4.7,97.5 9.63,97.5 9.71,97.42
  Bottom 3.5: 9.71,97.42 12.35,94.78 12.57,94.78 14.78,92.57 14.78,92.22 PAD2.1
N$14
  Bottom 3.5: X3.2 7.88,94.11 PAD1.1
N$15
  Bottom 3.5: PAD14.1 24.78,22.22 24.78,22.82 8.48,39.12 X5.1
N$16
  Bottom 3.5: PAD13.1 19.78,22.22 19.78,22.7 7.16,35.31 X5.2
N$32
  Bottom 3.5: X3.4 5.03,86.5 7.93,83.59 19.07,83.59 24.78,89.3 24.78,89.78 PAD4.1
N$35
  Bottom 3.5: PAD3.1 19.78,89.78 19.78,89.43 17.57,87.22 9.43,87.22 6.35,90.31 X3.3
N$38
  Bottom 3.5: PAD9.1 14.78,57.22 14.78,57.57 11.44,60.91 X4.3
N$40
  Bottom 3.5: X5.4 4.3,27.7 PAD16.1
N$42
  Top 1.27: R1.1 43.52,15.5 Q5.B 40.55,18.03 R20.1
N$43
  Bottom 3.5: PAD15.1 14.78,22.22 14.78,22.57 5.84,31.5 X5.3
N$292
  pour Top (isolate 0.406, rank 2, no thermals): 32.4,29.2 21.4,29.2 21.2,29.4 21.2,32.4 23.8,35 28.8,35 28.8,31.4 30.2,30 32.4,30
NC
  Bottom 2.54: K2.S 14.07,15.27 8.3,9.5 RELAYOUT.1
NO
  Bottom 2.54: RELAYOUT.3 11.69,1.89 13.13,3.33 K2.O
PROBE  (via drill 0.35)  (1 unrouted)
  Top 0.254: D10.A R22.2 v178,26.9 | v180.6,25.4 C29.2
  Bottom 0.254: v180.6,25.4 v178,26.9
PROBE_HV  (1 unrouted)
  Top 0.254: R26.2 180.42,21.72 178,19.3 D10.C
RELAY  (1 unrouted)
RESET  (1 unrouted)
  Top 0.508: R2.1 181.52,137.38 D1.A 183.4,137.1 | 183.4,137.1 184.7,137.1 C6.2 | IC1.1 183.81,135.39 183.4,135.8 183.4,137.1
SPDIR  (1 unrouted)
SPINDLE  (2 unrouted)
V3
  Top 0.305: U$2.4 81.03,14.56 80.7,14.9 C8.1
VUSB  (via drill 0.35)
  Top 0.813: U$2.16 84.84,5.54 v84.8,5.5
  Top 1.27: v84.8,5.5 84.8,4.25 D11.A
  Bottom 1.27: J1.VBUS 84.8,6.23 v84.8,5.5
X_MIN  (via drill 0.35)  (1 unrouted)
  Top 0.254: C22.2 v25.7,44.2 | D4.A R4.2 v18.5,44.2
  Bottom 0.254: v25.7,44.2 v18.5,44.2
X_MIN_HV
  Top 0.406: XMN.1 4.51,22.51 6.8,24.8 6.8,43 8,44.2 D4.C
XDIR  (1 unrouted)
XSTEP  (1 unrouted)
Y_MIN  (via drill 0.35)  (1 unrouted)
  Top 0.254: v25.7,48.2 C24.2 | D6.A R6.2 v18.5,48.2
  Bottom 0.254: v25.7,48.2 v18.5,48.2
Y_MIN_HV
  Top 0.406: D6.C 8.4,48.2 4.69,51.91 YMN.1
YDIR  (1 unrouted)
YSTEP  (1 unrouted)
Z_MIN  (via drill 0.35)  (2 unrouted)
  Top 0.254: D8.A 17.4,52.2 v18.6,52.2 | C28.2 v25.6,52.2
  Bottom 0.254: v18.6,52.2 v25.6,52.2
Z_MIN_HV
  Top 0.406: D8.C 7.8,52.2 6.8,53.2 6.8,79.8 5.29,81.31 ZMN.1
ZDIR  (1 unrouted)
ZSTEP  (1 unrouted)

### Text on the board
Top: +24v-
tPlace: 18pF | 16M | 18pF | 104 | 104 | 10K | M4 | 104 | 10uF | ATMEGA328 | Z-MOTOR | A A B B | Z-END | VM/GND/SIG | A A B B | Y-MOTOR | M4 | 10K | 0.1U | Y-END | VM/GND/SIG | M4 | 10K | 0.1U | GND/PWM/DIR | M4 | 10K | 0.1U | GND 24V | AUTORST | X-MOTOR | A A B B | MBRA210LT3 | RELAY | COOL | SPIND | 10K | 10U | 0.1U | M4 | 100K | X-END | VM/GND/SIG | 104 | +24v- | 22pF | CH340 | RELAY | SW/C/SW | 12M | 22pF
bPlace: Z-MOTOR | B- | B+ | A- | A+ | 24V | GND | GND | EN | GND | DIR | GND | STEP | SIG | GND | Z-END | 24V | Y-MOTOR | B- | B+ | A- | A+ | 24V | GND | GND | EN | GND | DIR | GND | STEP | SIG | GND | Y-END | 24V | X-MOTOR | SIG | GND | B- | B+ | A- | A+ | 24V | GND | GND | EN | GND | DIR | GND | STEP | X-END | 24V | SIG | GND | PROBE | 24V
tStop: +24v-